# Altium schematic sheet Var9.SchDoc
size A4; SheetNumber: 12; SheetTotal: 12
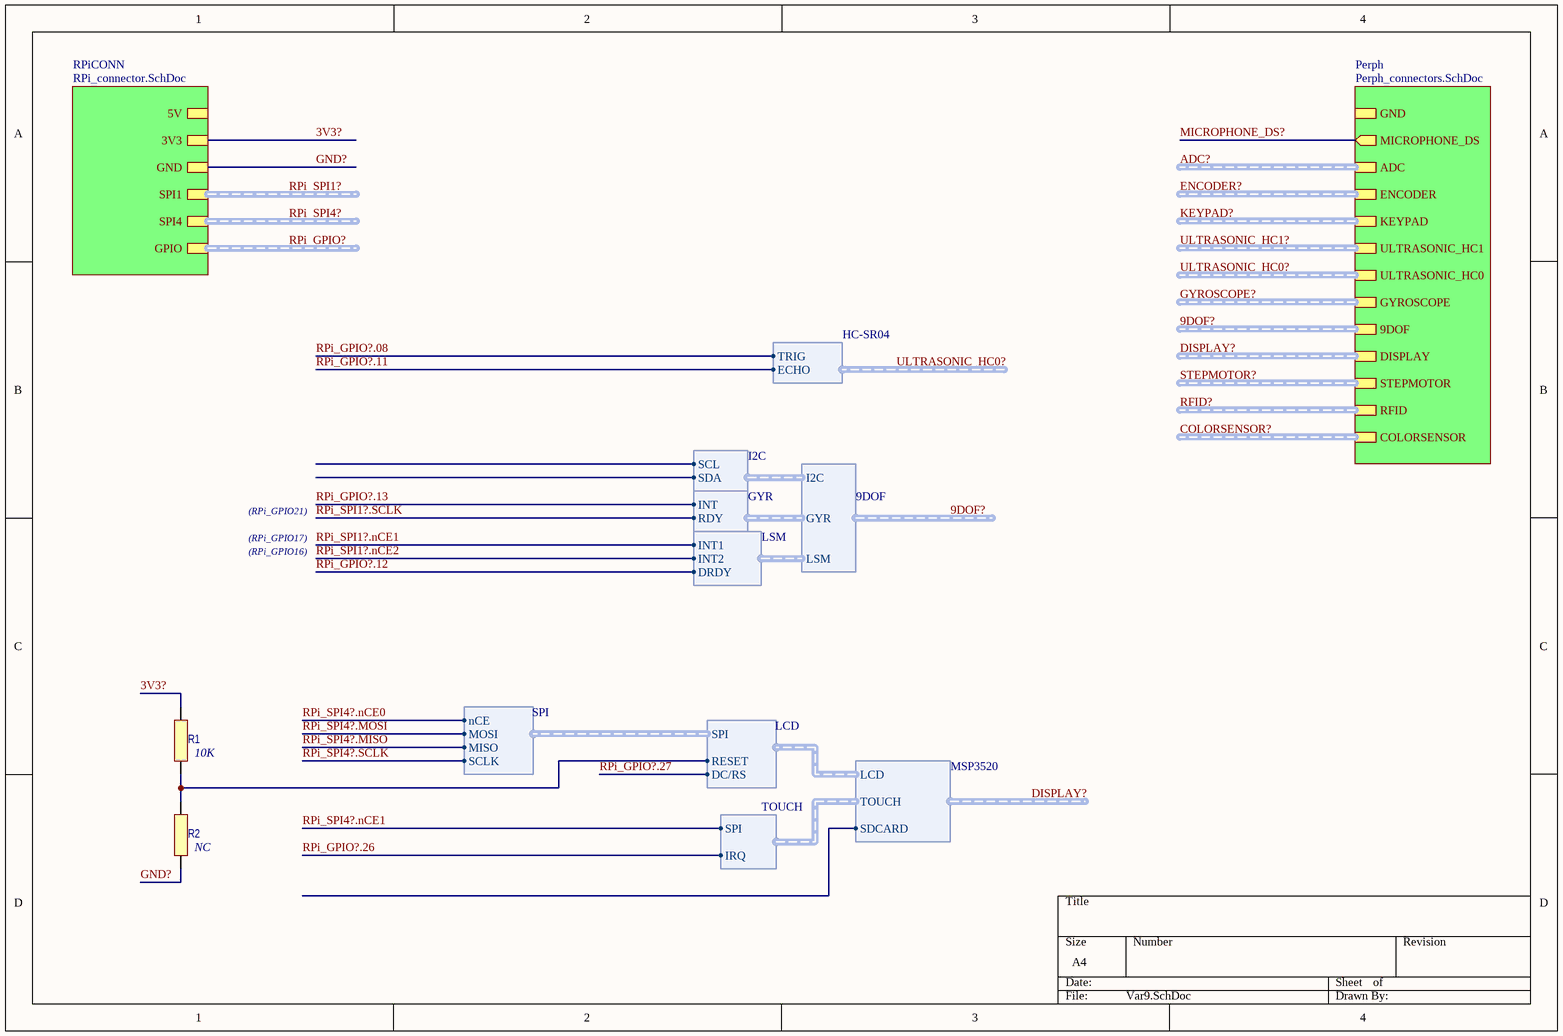
[diagram p0: Var9.SchDoc]

## Parts
R1  value 10K  [R0805]  (hidden comment: R0805)
R2  value NC  [R0805]  (hidden comment: R0805)

## Sub-sheets
Perph = Perph_connectors.SchDoc: MICROPHONE_DS (out), ADC (harness ADS1115 module), GYROSCOPE (harness GY-50 L3GD20 Gyro), ULTRASONIC_HC1 (harness HC-SR04), GND, KEYPAD (harness Keypad COM-08653), ULTRASONIC_HC0 (harness HC-SR04), DISPLAY (harness MSP3520), STEPMOTOR (harness ULN2003 Module), RFID (harness RC522), ENCODER (harness KY-040), COLORSENSOR (harness TCS34725), 9DOF (harness 9DOF)
RPiCONN = RPi_connector.SchDoc: 5V, 3V3, GND, SPI4 (harness SPI_2CS), SPI1 (harness SPI_3CS), GPIO (harness RPI_GPIO)

## Harnesses
SPI: nCE, MISO, MOSI, SCLK
LCD: SPI, RESET, DC/RS
TOUCH: SPI, IRQ
MSP3520: LCD, TOUCH, SDCARD
HC-SR04: ECHO, TRIG
I2C: SCL, SDA
9DOF: I2C, GYR, LSM
GYR: INT, RDY
LSM: INT1, DRDY, INT2

## Nets
3V3?: R1.1 ; sheet RPiCONN/3V3
GND?: R2.2 ; sheet RPiCONN/GND
MICROPHONE_DS?: sheet Perph/MICROPHONE_DS
RPi_GPIO?.08: sheet Perph/ULTRASONIC_HC0.TRIG
RPi_GPIO?.11: sheet Perph/ULTRASONIC_HC0.ECHO
RPi_GPIO?.12: harness LSM.DRDY
RPi_GPIO?.13: harness GYR.INT
RPi_GPIO?.26: harness TOUCH.IRQ
RPi_GPIO?.27: harness LCD.DC/RS
RPi_SPI1?.nCE1: harness LSM.INT1
RPi_SPI1?.nCE2: harness LSM.INT2
RPi_SPI1?.SCLK: harness GYR.RDY
RPi_SPI4?.MISO: harness SPI.MISO
RPi_SPI4?.MOSI: harness SPI.MOSI
RPi_SPI4?.nCE0: harness SPI.nCE
RPi_SPI4?.SCLK: harness SPI.SCLK
NetR1_2: R1.2 R2.1 ; harness LCD.RESET

## Buses and harness runs
harness 9DOF? = sheet Perph/9DOF
harness ADC? = sheet Perph/ADC
harness COLORSENSOR? = sheet Perph/COLORSENSOR
harness DISPLAY? = sheet Perph/DISPLAY
harness ENCODER? = sheet Perph/ENCODER
harness GYROSCOPE? = sheet Perph/GYROSCOPE
harness KEYPAD? = sheet Perph/KEYPAD
harness RFID? = sheet Perph/RFID
harness RPi_GPIO? = sheet RPiCONN/GPIO
harness RPi_SPI1? = sheet RPiCONN/SPI1
harness RPi_SPI4? = sheet RPiCONN/SPI4
harness STEPMOTOR? = sheet Perph/STEPMOTOR
harness ULTRASONIC_HC0? = sheet Perph/ULTRASONIC_HC0
harness ULTRASONIC_HC1? = sheet Perph/ULTRASONIC_HC1

## Notes on the sheet
- (RPi_GPIO21)
- (RPi_GPIO17)
- (RPi_GPIO16)

## Library data of the parts
R1 R2 = R0805: Case: *; Mount: *; PartNumber: *; Power: *; Tolerance: *